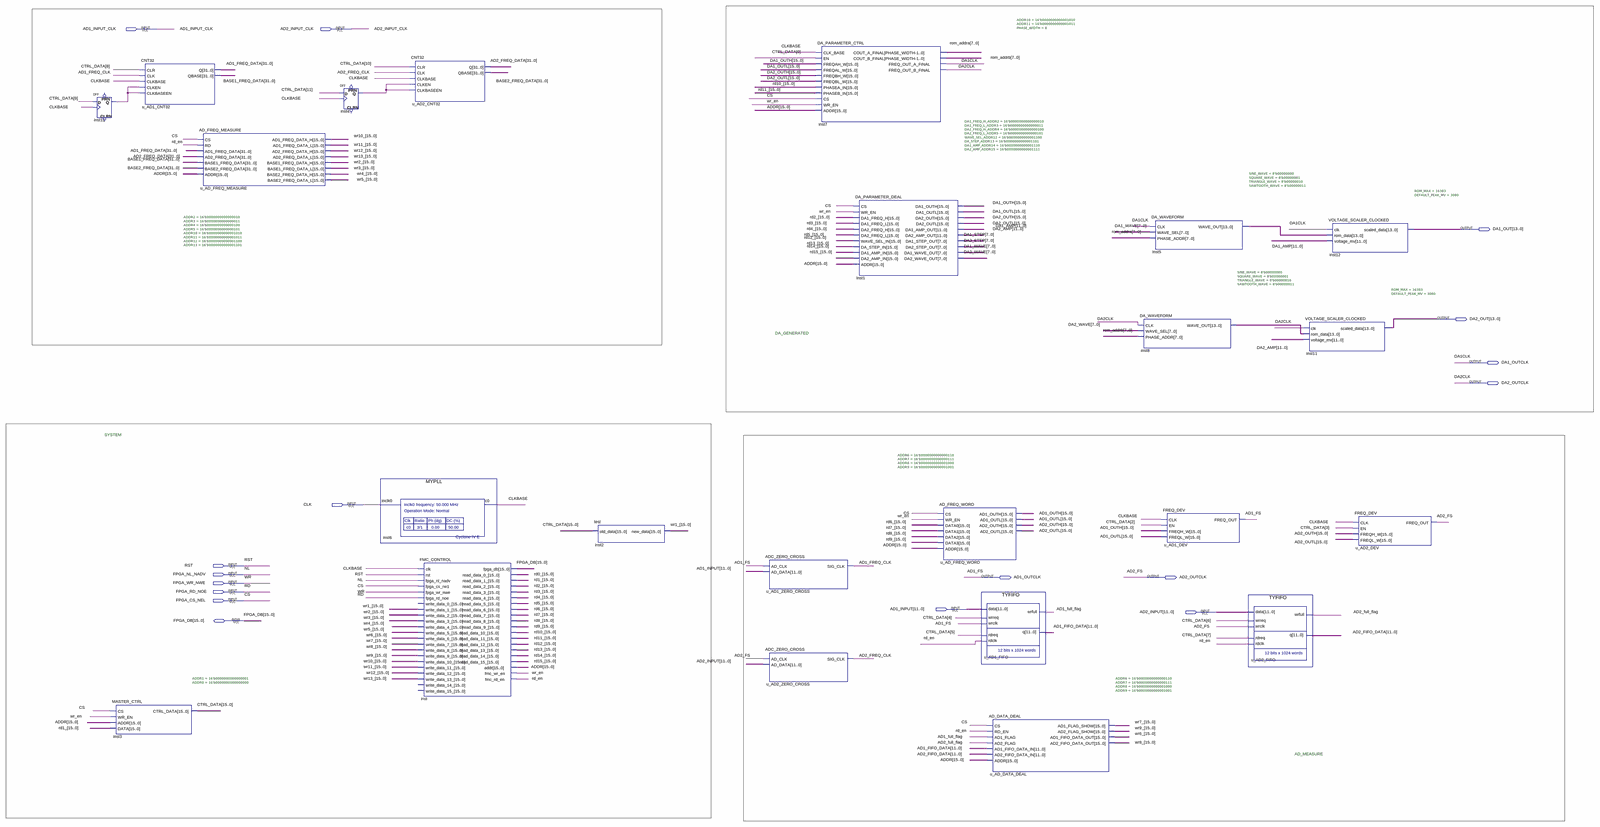
[diagram p0: schematic sheet, whole]
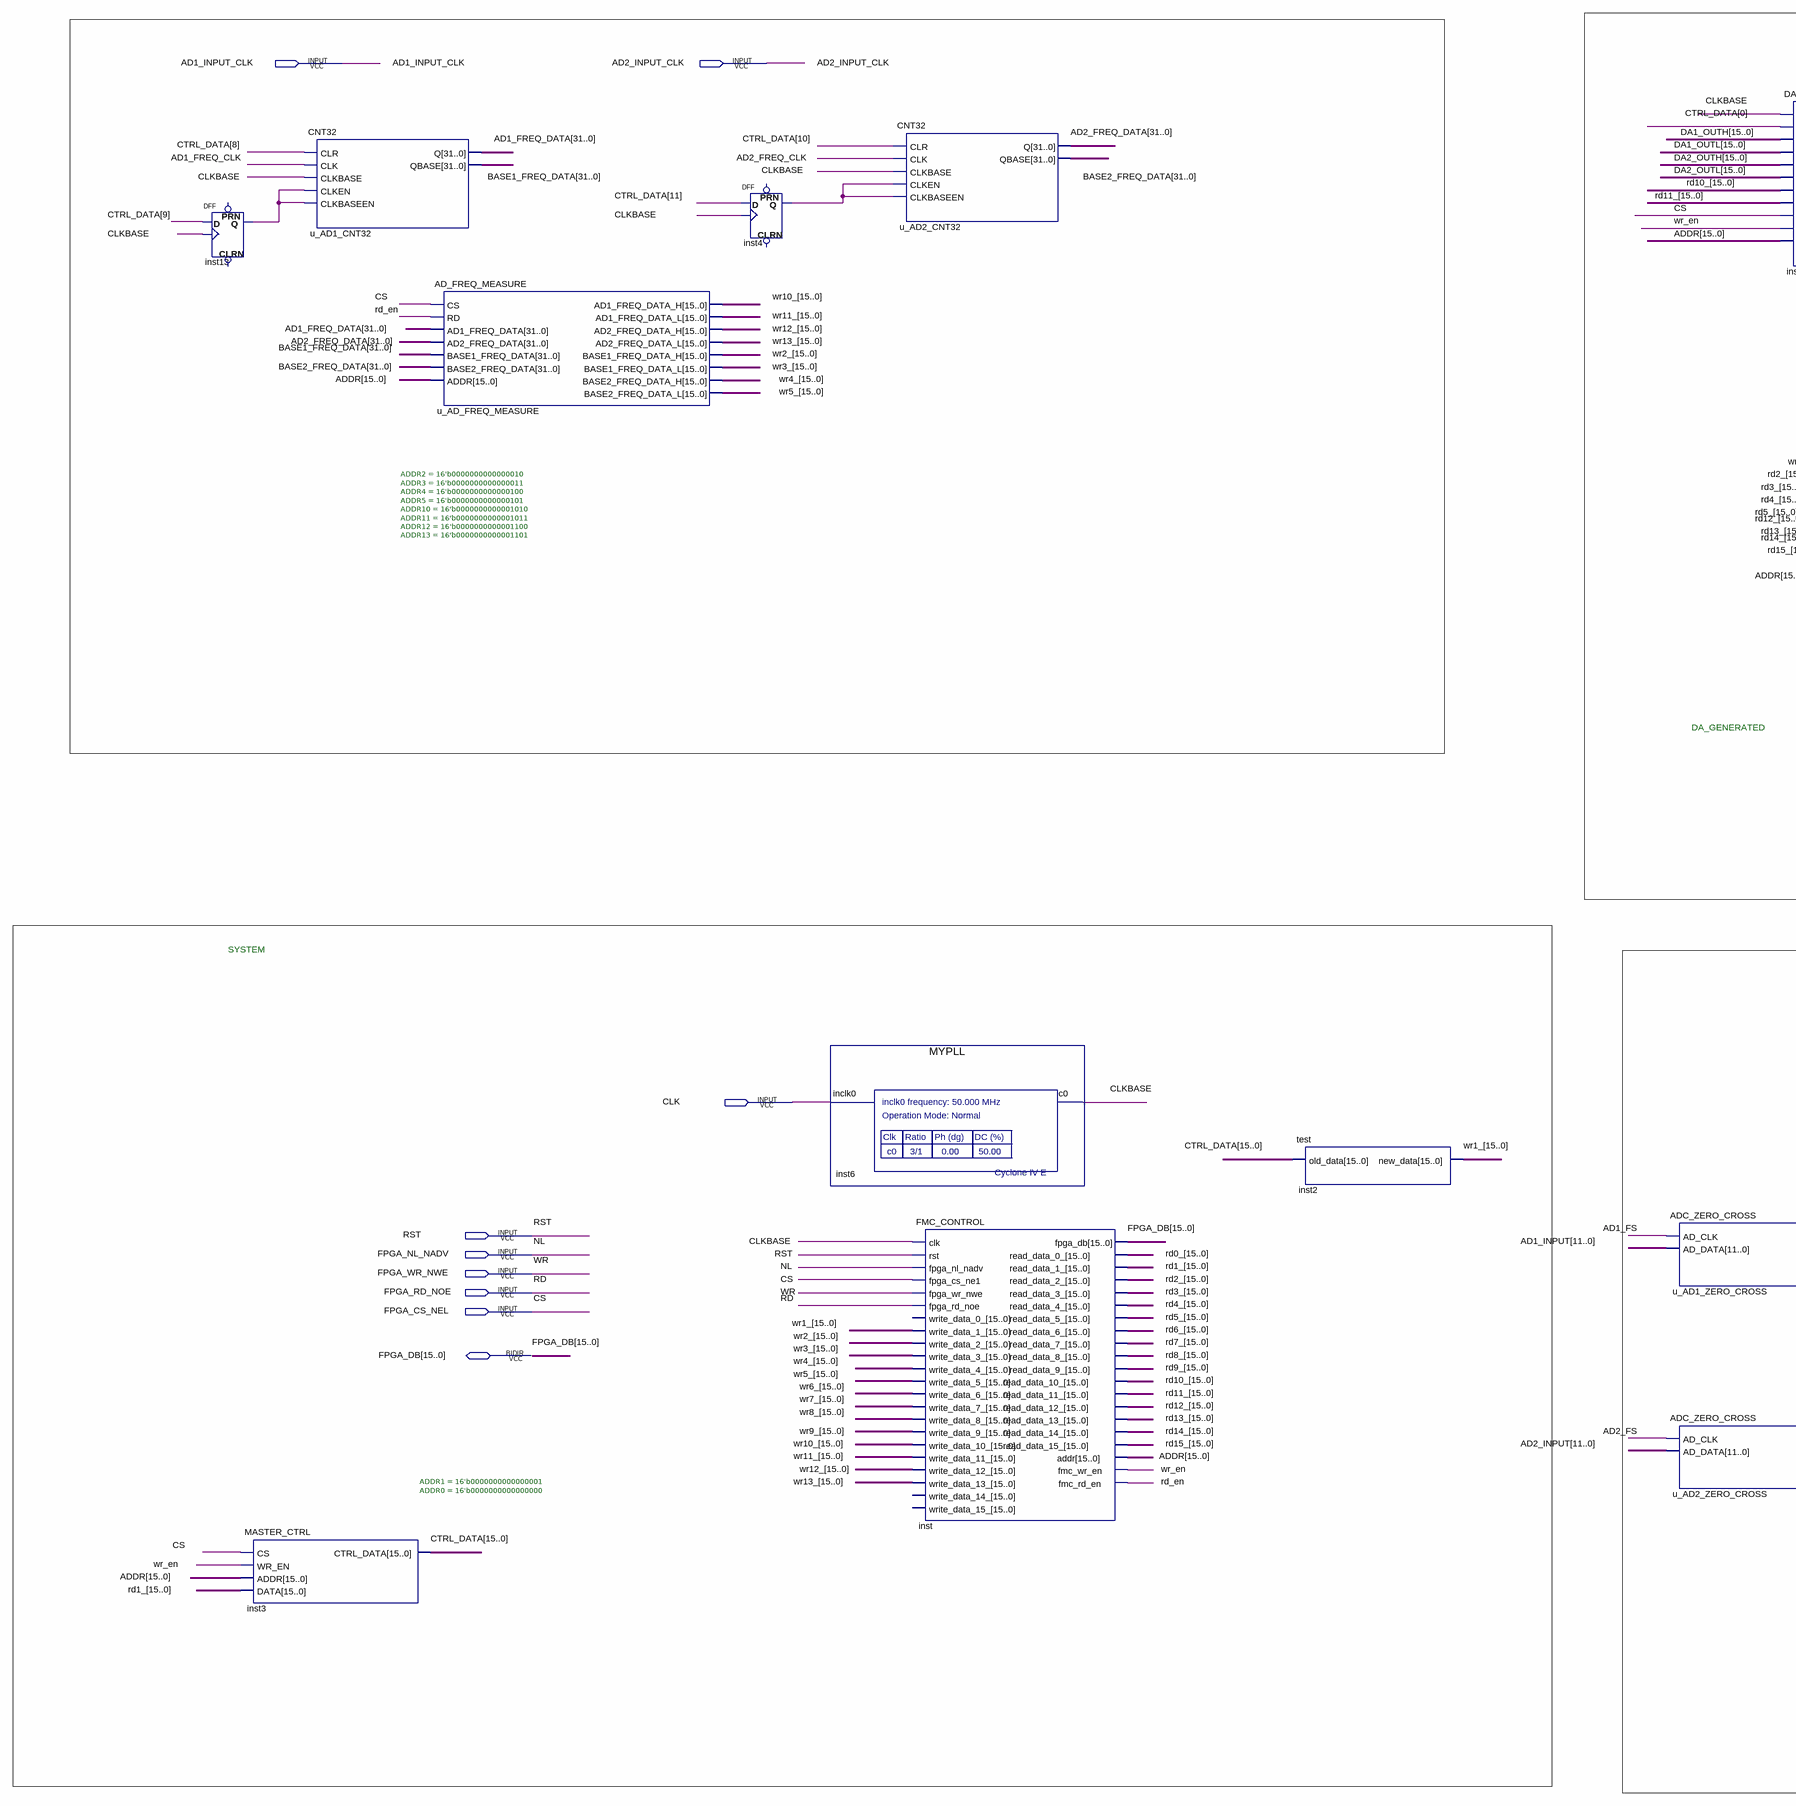
[diagram p1: schematic sheet, left part]
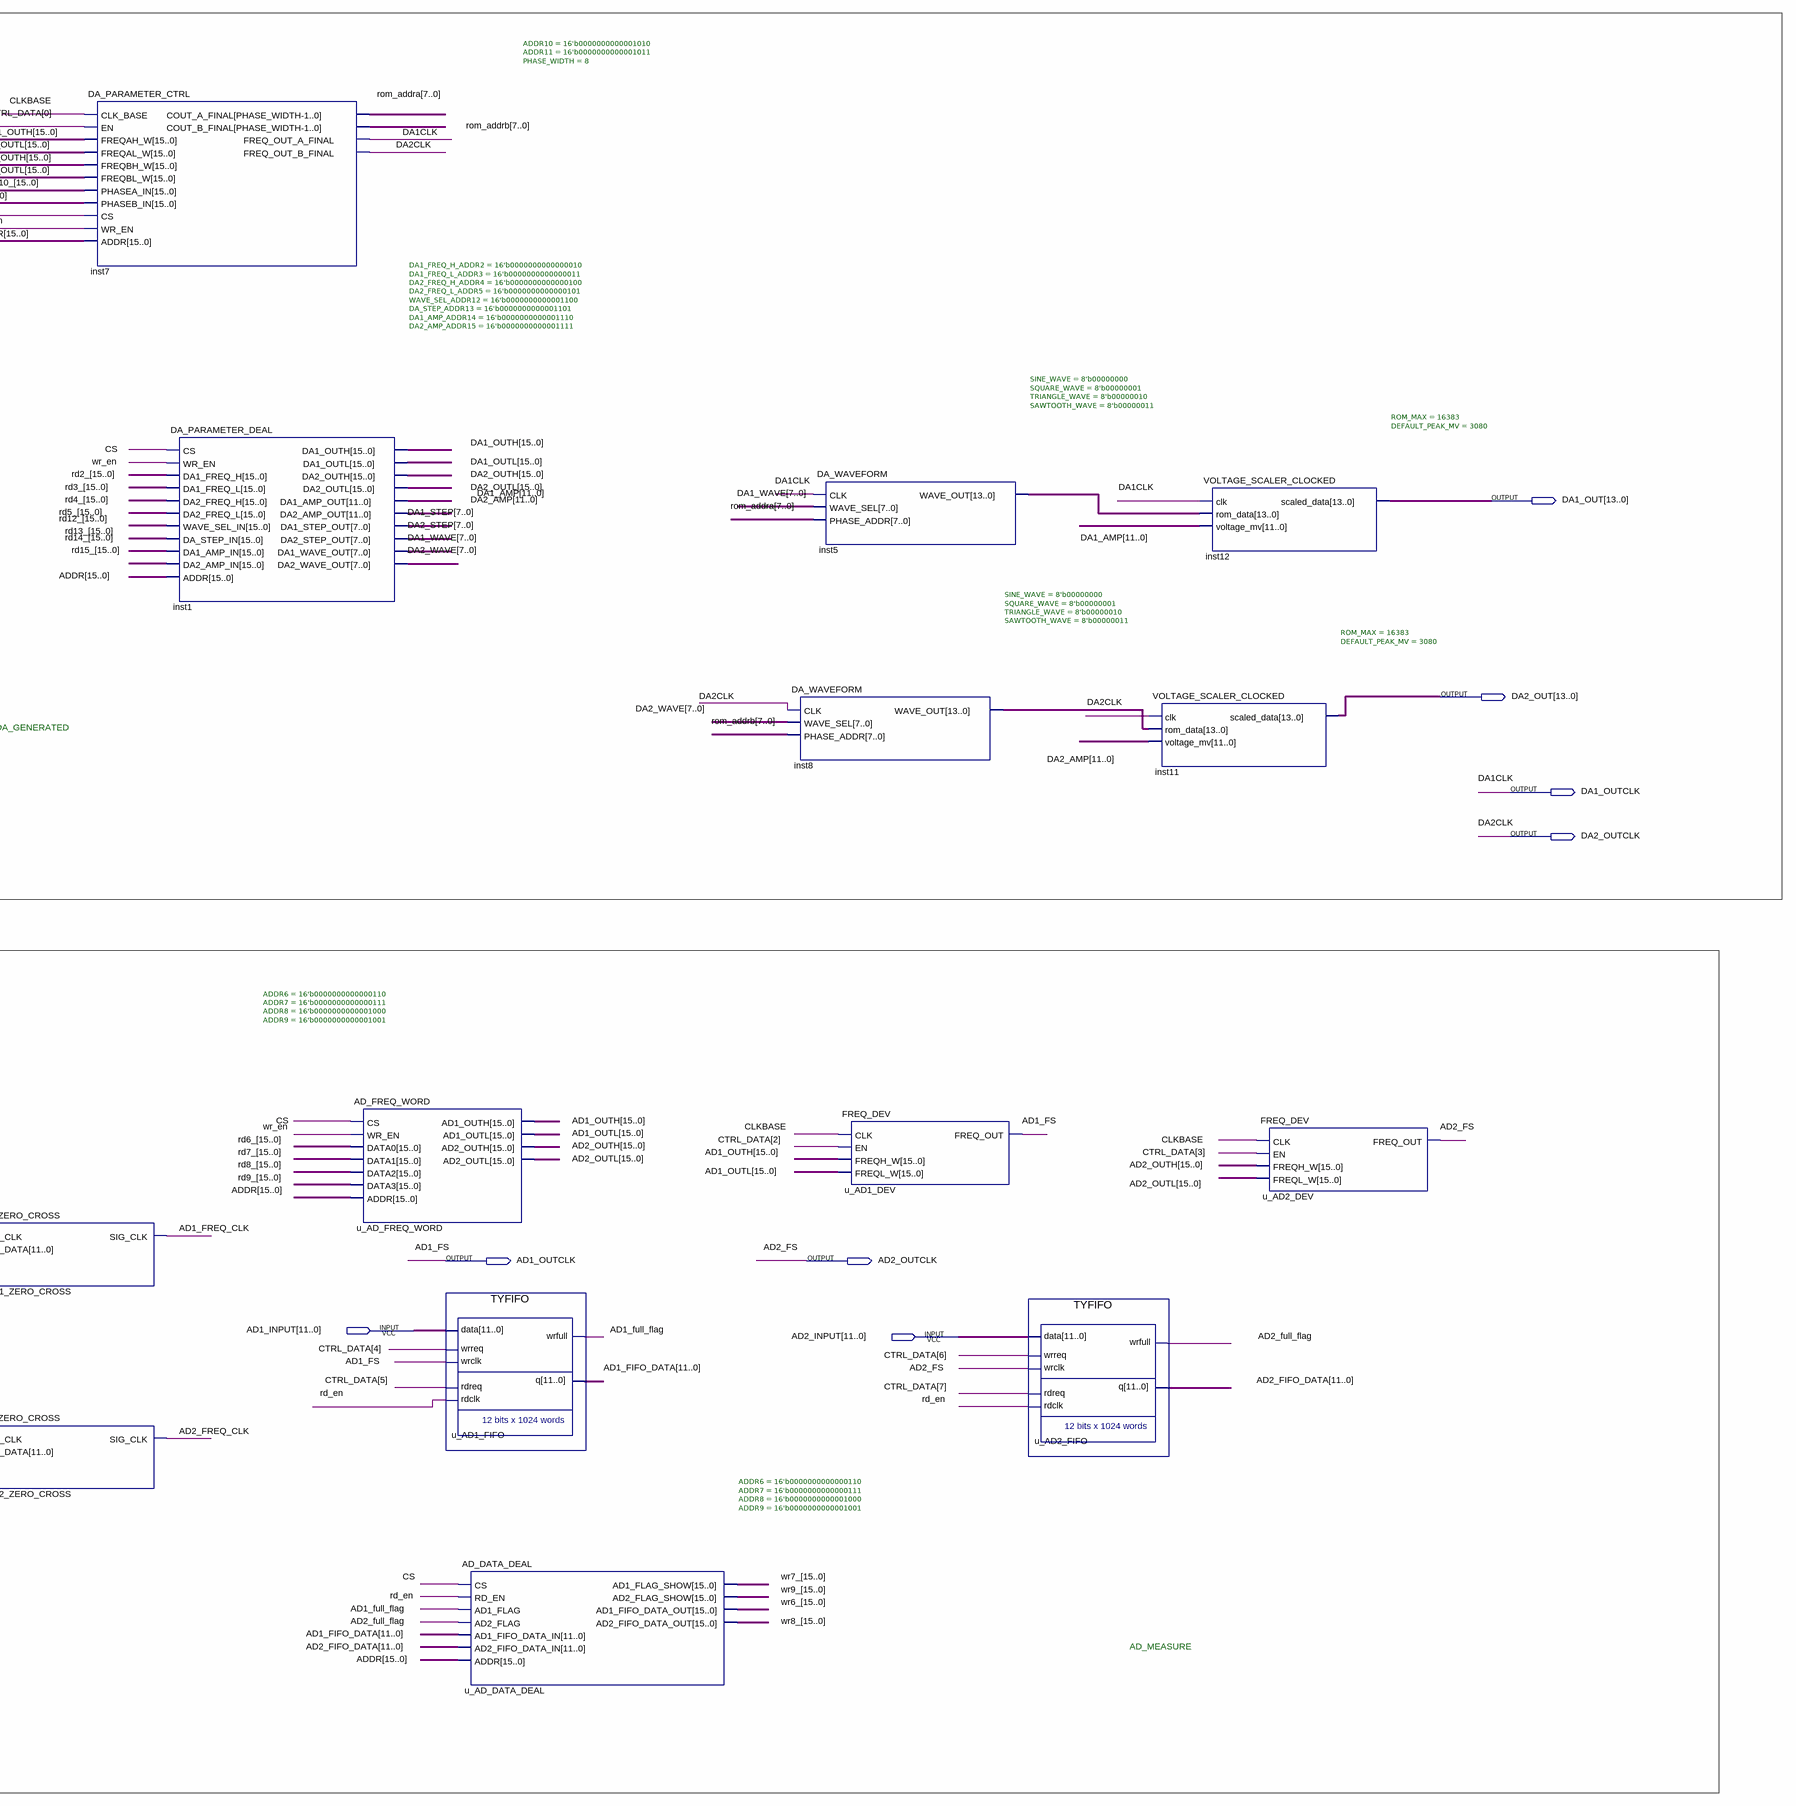
[diagram p2: schematic sheet, right part]
// Quartus schematic TOP.bdf as structural Verilog: 23 symbols, 17 pins
module TOP (
  input  AD1_INPUT_CLK,
  input  AD2_INPUT_CLK,
  input  CLK,
  input  RST,
  input  FPGA_NL_NADV,
  input  FPGA_WR_NWE,
  input  FPGA_RD_NOE,
  input  FPGA_CS_NEL,
  input  [11:0] AD1_INPUT,
  input  [11:0] AD2_INPUT,
  inout  [15:0] FPGA_DB,
  output [13:0] DA1_OUT,
  output [13:0] DA2_OUT,
  output DA1_OUTCLK,
  output DA2_OUTCLK,
  output AD1_OUTCLK,
  output AD2_OUTCLK
);

  wire AD1_FREQ_CLK, AD1_full_flag, AD2_FREQ_CLK, AD2_full_flag, CLKBASE, inst4_q, inst13_q, rd_en, wr_en;
  wire [7:0] DA1_STEP, DA1_WAVE, DA2_STEP, DA2_WAVE, rom_addra, rom_addrb;
  wire [11:0] AD1_FIFO_DATA, AD2_FIFO_DATA, DA1_AMP, DA2_AMP;
  wire [13:0] inst5_wave_out, inst8_wave_out;
  wire [15:0] AD1_OUTH, AD1_OUTL, AD2_OUTH, AD2_OUTL, ADDR, CTRL_DATA, DA1_OUTH, DA1_OUTL, DA2_OUTH,
       DA2_OUTL, rd0_, rd1_, rd2_, rd3_, rd4_, rd5_, rd6_, rd7_, rd8_, rd9_, rd10_, rd11_, rd12_, rd13_,
       rd14_, rd15_, wr1_, wr2_, wr3_, wr4_, wr5_, wr6_, wr7_, wr8_, wr9_, wr10_, wr11_, wr12_, wr13_;
  wire [31:0] AD1_FREQ_DATA, AD2_FREQ_DATA, BASE1_FREQ_DATA, BASE2_FREQ_DATA;

  DFF inst13 (.CLK(CLKBASE), .D(CTRL_DATA[9]), .Q(inst13_q));  // open: CLRN, PRN
  MASTER_CTRL #(.ADDR1(16'b0000000000000001), .ADDR0(16'b0000000000000000)) inst3 (
    .CS(FPGA_CS_NEL), .WR_EN(wr_en), .ADDR(ADDR), .DATA(rd1_), .CTRL_DATA(CTRL_DATA));
  CNT32 u_AD1_CNT32 (
    .CLR(CTRL_DATA[8]), .CLK(AD1_FREQ_CLK), .CLKBASE(CLKBASE), .CLKEN(inst13_q), .CLKBASEEN(inst13_q),
    .Q(AD1_FREQ_DATA), .QBASE(BASE1_FREQ_DATA));
  AD_FREQ_MEASURE #(.ADDR2(16'b0000000000000010), .ADDR3(16'b0000000000000011), .ADDR4(16'b0000000000000100), .ADDR5(16'b0000000000000101), .ADDR10(16'b0000000000001010), .ADDR11(16'b0000000000001011), .ADDR12(16'b0000000000001100), .ADDR13(16'b0000000000001101)) u_AD_FREQ_MEASURE (
    .CS(FPGA_CS_NEL), .RD(rd_en), .AD1_FREQ_DATA(AD1_FREQ_DATA), .AD2_FREQ_DATA(AD2_FREQ_DATA),
    .BASE1_FREQ_DATA(BASE1_FREQ_DATA), .BASE2_FREQ_DATA(BASE2_FREQ_DATA), .ADDR(ADDR),
    .AD1_FREQ_DATA_H(wr10_), .AD1_FREQ_DATA_L(wr11_), .AD2_FREQ_DATA_H(wr12_), .AD2_FREQ_DATA_L(wr13_),
    .BASE1_FREQ_DATA_H(wr2_), .BASE1_FREQ_DATA_L(wr3_), .BASE2_FREQ_DATA_H(wr4_), .BASE2_FREQ_DATA_L(wr5_));
  DFF inst4 (.CLK(CLKBASE), .D(CTRL_DATA[11]), .Q(inst4_q));  // open: CLRN, PRN
  MYPLL inst6 (.inclk0(CLK), .c0(CLKBASE));
  CNT32 u_AD2_CNT32 (
    .CLR(CTRL_DATA[10]), .CLK(AD2_FREQ_CLK), .CLKBASE(CLKBASE), .CLKEN(inst4_q), .CLKBASEEN(inst4_q),
    .Q(AD2_FREQ_DATA), .QBASE(BASE2_FREQ_DATA));
  FMC_CONTROL inst (
    .clk(CLKBASE), .rst(RST), .fpga_nl_nadv(FPGA_NL_NADV), .fpga_cs_ne1(FPGA_CS_NEL),
    .fpga_wr_nwe(FPGA_WR_NWE), .fpga_rd_noe(FPGA_RD_NOE), .write_data_1_(wr1_), .write_data_2_(wr2_),
    .write_data_3_(wr3_), .write_data_4_(wr4_), .write_data_5_(wr5_), .write_data_6_(wr6_),
    .write_data_7_(wr7_), .write_data_8_(wr8_), .write_data_9_(wr9_), .write_data_10_(wr10_),
    .write_data_11_(wr11_), .write_data_12_(wr12_), .write_data_13_(wr13_), .read_data_0_(rd0_),
    .read_data_1_(rd1_), .read_data_2_(rd2_), .read_data_3_(rd3_), .read_data_4_(rd4_), .read_data_5_(rd5_),
    .read_data_6_(rd6_), .read_data_7_(rd7_), .read_data_8_(rd8_), .read_data_9_(rd9_),
    .read_data_10_(rd10_), .read_data_11_(rd11_), .read_data_12_(rd12_), .read_data_13_(rd13_),
    .read_data_14_(rd14_), .read_data_15_(rd15_), .addr(ADDR), .fmc_wr_en(wr_en), .fmc_rd_en(rd_en),
    .fpga_db(FPGA_DB));  // open: write_data_0_, write_data_14_, write_data_15_
  test inst2 (.old_data(CTRL_DATA), .new_data(wr1_));
  ADC_ZERO_CROSS #(.MID_CODE(2048), .HYSTERESIS(64)) u_AD1_ZERO_CROSS (
    .AD_CLK(AD1_OUTCLK), .AD_DATA(AD1_INPUT), .SIG_CLK(AD1_FREQ_CLK));
  ADC_ZERO_CROSS #(.MID_CODE(2048), .HYSTERESIS(64)) u_AD2_ZERO_CROSS (
    .AD_CLK(AD2_OUTCLK), .AD_DATA(AD2_INPUT), .SIG_CLK(AD2_FREQ_CLK));
  DA_PARAMETER_CTRL #(.ADDR10(16'b0000000000001010), .ADDR11(16'b0000000000001011), .PHASE_WIDTH(8)) inst7 (
    .CLK_BASE(CLKBASE), .EN(CTRL_DATA[0]), .FREQAH_W(DA1_OUTH), .FREQAL_W(DA1_OUTL), .FREQBH_W(DA2_OUTH),
    .FREQBL_W(DA2_OUTL), .PHASEA_IN(rd10_), .PHASEB_IN(rd11_), .CS(FPGA_CS_NEL), .WR_EN(wr_en), .ADDR(ADDR),
    .COUT_A_FINAL(rom_addra), .COUT_B_FINAL(rom_addrb), .FREQ_OUT_A_FINAL(DA1_OUTCLK),
    .FREQ_OUT_B_FINAL(DA2_OUTCLK));
  DA_PARAMETER_DEAL #(.DA1_FREQ_H_ADDR2(16'b0000000000000010), .DA1_FREQ_L_ADDR3(16'b0000000000000011), .DA2_FREQ_H_ADDR4(16'b0000000000000100), .DA2_FREQ_L_ADDR5(16'b0000000000000101), .WAVE_SEL_ADDR12(16'b0000000000001100), .DA_STEP_ADDR13(16'b0000000000001101), .DA1_AMP_ADDR14(16'b0000000000001110), .DA2_AMP_ADDR15(16'b0000000000001111)) inst1 (
    .CS(FPGA_CS_NEL), .WR_EN(wr_en), .DA1_FREQ_H(rd2_), .DA1_FREQ_L(rd3_), .DA2_FREQ_H(rd4_),
    .DA2_FREQ_L(rd5_), .WAVE_SEL_IN(rd12_), .DA_STEP_IN(rd13_), .DA1_AMP_IN(rd14_), .DA2_AMP_IN(rd15_),
    .ADDR(ADDR), .DA1_OUTH(DA1_OUTH), .DA1_OUTL(DA1_OUTL), .DA2_OUTH(DA2_OUTH), .DA2_OUTL(DA2_OUTL),
    .DA1_AMP_OUT(DA1_AMP), .DA2_AMP_OUT(DA2_AMP), .DA1_STEP_OUT(DA1_STEP), .DA2_STEP_OUT(DA2_STEP),
    .DA1_WAVE_OUT(DA1_WAVE), .DA2_WAVE_OUT(DA2_WAVE));
  AD_FREQ_WORD #(.ADDR6(16'b0000000000000110), .ADDR7(16'b0000000000000111), .ADDR8(16'b0000000000001000), .ADDR9(16'b0000000000001001)) u_AD_FREQ_WORD (
    .CS(FPGA_CS_NEL), .WR_EN(wr_en), .DATA0(rd6_), .DATA1(rd7_), .DATA2(rd8_), .DATA3(rd9_), .ADDR(ADDR),
    .AD1_OUTH(AD1_OUTH), .AD1_OUTL(AD1_OUTL), .AD2_OUTH(AD2_OUTH), .AD2_OUTL(AD2_OUTL));
  TYFIFO u_AD1_FIFO (
    .data(AD1_INPUT), .wrreq(CTRL_DATA[4]), .wrclk(AD1_OUTCLK), .rdreq(CTRL_DATA[5]), .rdclk(rd_en),
    .wrfull(AD1_full_flag), .q(AD1_FIFO_DATA));
  AD_DATA_DEAL #(.ADDR6(16'b0000000000000110), .ADDR7(16'b0000000000000111), .ADDR8(16'b0000000000001000), .ADDR9(16'b0000000000001001)) u_AD_DATA_DEAL (
    .CS(FPGA_CS_NEL), .RD_EN(rd_en), .AD1_FLAG(AD1_full_flag), .AD2_FLAG(AD2_full_flag),
    .AD1_FIFO_DATA_IN(AD1_FIFO_DATA), .AD2_FIFO_DATA_IN(AD2_FIFO_DATA), .ADDR(ADDR), .AD1_FLAG_SHOW(wr7_),
    .AD2_FLAG_SHOW(wr9_), .AD1_FIFO_DATA_OUT(wr6_), .AD2_FIFO_DATA_OUT(wr8_));
  DA_WAVEFORM #(.SINE_WAVE(8'b00000000), .SQUARE_WAVE(8'b00000001), .TRIANGLE_WAVE(8'b00000010), .SAWTOOTH_WAVE(8'b00000011)) inst5 (
    .CLK(DA1_OUTCLK), .WAVE_SEL(DA1_WAVE), .PHASE_ADDR(rom_addra), .WAVE_OUT(inst5_wave_out));
  DA_WAVEFORM #(.SINE_WAVE(8'b00000000), .SQUARE_WAVE(8'b00000001), .TRIANGLE_WAVE(8'b00000010), .SAWTOOTH_WAVE(8'b00000011)) inst8 (
    .CLK(DA2_OUTCLK), .WAVE_SEL(DA2_WAVE), .PHASE_ADDR(rom_addrb), .WAVE_OUT(inst8_wave_out));
  FREQ_DEV u_AD1_DEV (.CLK(CLKBASE), .EN(CTRL_DATA[2]), .FREQH_W(AD1_OUTH), .FREQL_W(AD1_OUTL), .FREQ_OUT(AD1_OUTCLK));
  TYFIFO u_AD2_FIFO (
    .data(AD2_INPUT), .wrreq(CTRL_DATA[6]), .wrclk(AD2_OUTCLK), .rdreq(CTRL_DATA[7]), .rdclk(rd_en),
    .wrfull(AD2_full_flag), .q(AD2_FIFO_DATA));
  VOLTAGE_SCALER_CLOCKED #(.ROM_MAX(16383), .DEFAULT_PEAK_MV(3080)) inst11 (
    .clk(DA2_OUTCLK), .rom_data(inst8_wave_out), .voltage_mv(DA2_AMP), .scaled_data(DA2_OUT));
  VOLTAGE_SCALER_CLOCKED #(.ROM_MAX(16383), .DEFAULT_PEAK_MV(3080)) inst12 (
    .clk(DA1_OUTCLK), .rom_data(inst5_wave_out), .voltage_mv(DA1_AMP), .scaled_data(DA1_OUT));
  FREQ_DEV u_AD2_DEV (.CLK(CLKBASE), .EN(CTRL_DATA[3]), .FREQH_W(AD2_OUTH), .FREQL_W(AD2_OUTL), .FREQ_OUT(AD2_OUTCLK));

  // Other names for the same wires on the sheet: AD1_FS = AD1_OUTCLK; AD2_FS = AD2_OUTCLK; CS = FPGA_CS_NEL;
  //   DA1CLK = DA1_OUTCLK; DA2CLK = DA2_OUTCLK; NL = FPGA_NL_NADV; RD = FPGA_RD_NOE; WR = FPGA_WR_NWE

  // Notes on the sheet:
  //   DA_GENERATED
  //   SYSTEM
  //   AD_MEASURE
endmodule
